# EAGLE design board (EAGLE 9.3.1)
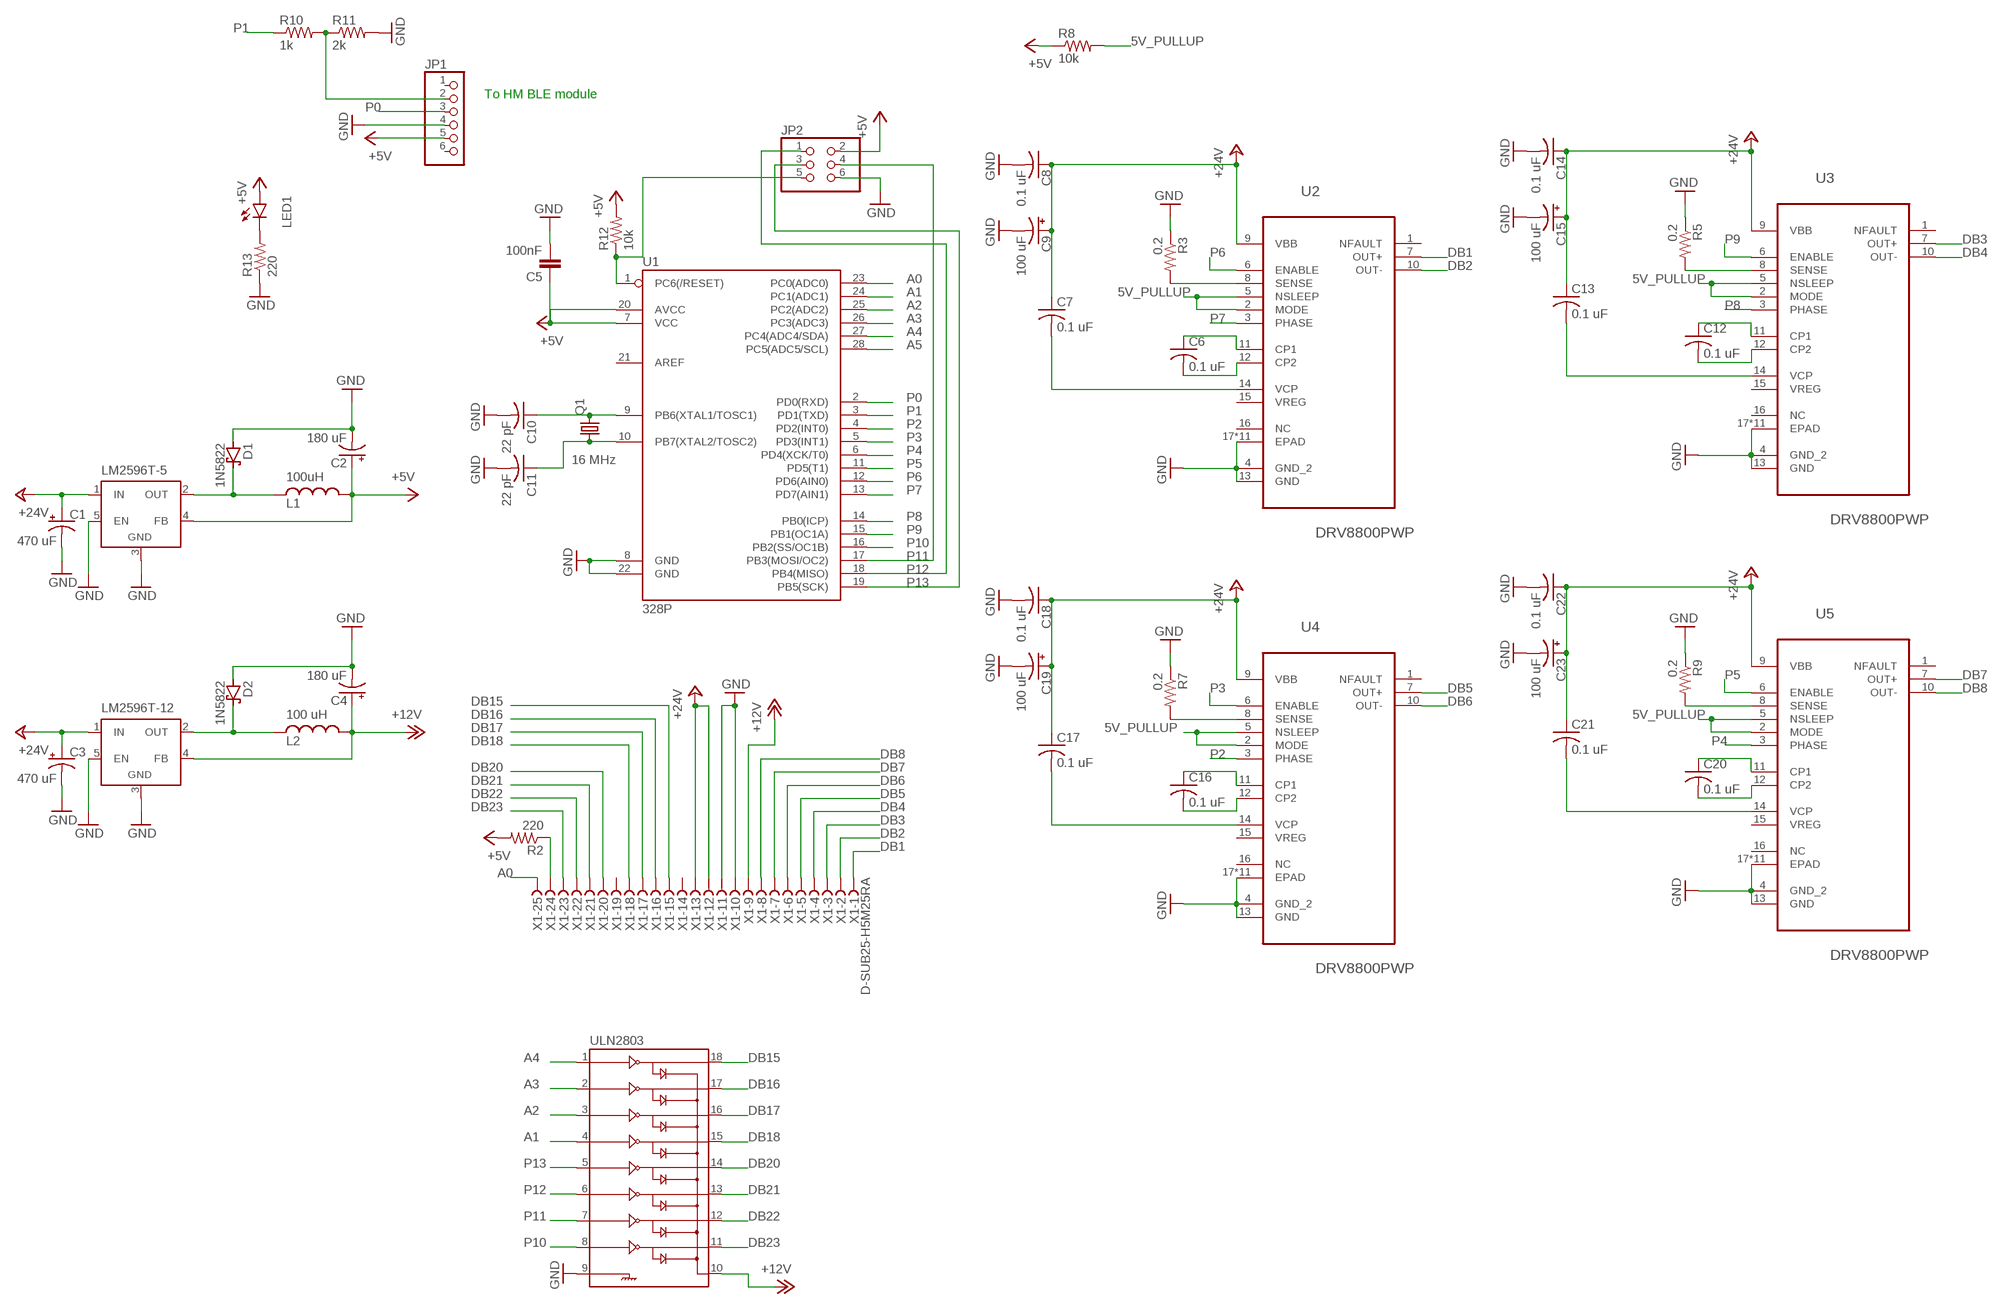
[diagram p0: schematic, sheet 1]

## Parts
C1  470 uF  CPOL-USE3.5-8  [E3,5-8]
C2  180 uF  CPOL-USE3.5-8  [E3,5-8]
C3  470 uF  CPOL-USE3.5-8  [E3,5-8]
C4  180 uF  CPOL-USE3.5-8  [E3,5-8]
C5  100nF  C-EUC0805  [C0805]
C6  0.1 uF  C-USC0805  [C0805]
C7  0.1 uF  C-USC0805  [C0805]
C8  0.1 uF  C-USC0805  [C0805]
C9  100 uF  CPOL-USE3.5-8  [E3,5-8]
C10  22 pF  C-USC0805  [C0805]
C11  22 pF  C-USC0805  [C0805]
C12  0.1 uF  C-USC0805  [C0805]
C13  0.1 uF  C-USC0805  [C0805]
C14  0.1 uF  C-USC0805  [C0805]
C15  100 uF  CPOL-USE3.5-8  [E3,5-8]
C16  0.1 uF  C-USC0805  [C0805]
C17  0.1 uF  C-USC0805  [C0805]
C18  0.1 uF  C-USC0805  [C0805]
C19  100 uF  CPOL-USE3.5-8  [E3,5-8]
C20  0.1 uF  C-USC0805  [C0805]
C21  0.1 uF  C-USC0805  [C0805]
C22  0.1 uF  C-USC0805  [C0805]
C23  100 uF  CPOL-USE3.5-8  [E3,5-8]
D1  1N5822  SCHOTTKY-DIODEDO201T15  [DO201T15]
D2  1N5822  SCHOTTKY-DIODEDO201T15  [DO201T15]
JP1  PINHD-1X6  [1X06]
JP2  PINHD-2X3  [2X03]
L1  100uH  SRR1260  [SRR1260]
L2  100 uH  SRR1260  [SRR1260]
LED1  LED5MM  [LED5MM]
LM2596T-5  LM2596TV  [TO220-51]
LM2596T-12  LM2596TV  [TO220-51]
Q1  16 MHz  CRYSTALHC49S  [HC49/S]
R2  220  R-US_R0805  [R0805]
R3  0.2  R-US_R0805  [R0805]
R5  0.2  R-US_R0805  [R0805]
R7  0.2  R-US_R0805  [R0805]
R8  10k  R-US_R0805  [R0805]
R9  0.2  R-US_R0805  [R0805]
R10  1k  R-US_R0805  [R0805]
R11  2k  R-US_R0805  [R0805]
R12  10k  R-US_R0805  [R0805]
R13  220  R-US_R0805  [R0805]
U1  328P  ATMEGA328P_PDIP  [DIP28]
U2  DRV8800PWP  [SOP65P640X120-17N]
U3  DRV8800PWP  [SOP65P640X120-17N]
U4  DRV8800PWP  [SOP65P640X120-17N]
U5  DRV8800PWP  [SOP65P640X120-17N]
ULN2803  ULN2803DIP  [DIL18]
X1  D-SUB25-H5M25RA  [H5M25RA]

## Nets
5V_PULLUP: R8.2 U2.2(MODE) U2.5(NSLEEP) U3.2(MODE) U3.5(NSLEEP) U4.2(MODE) U4.5(NSLEEP) U5.2(MODE) U5.5(NSLEEP)
+5V: C2.+ C5.1 JP1.5 JP2.2 L1.2 LED1.A LM2596T-5.4(FB) R2.2 R8.1 R12.2 U1.7(VCC) U1.20(AVCC)
+12V: C4.+ L2.2 LM2596T-12.4(FB) ULN2803.10 X1.9
+24V: C1.+ C3.+ C7.1 C8.1 C9.+ C13.1 C14.1 C15.+ C17.1 C18.1 C19.+ C21.1 C22.1 C23.+ LM2596T-5.1(IN) LM2596T-12.1(IN) U2.9(VBB) U3.9(VBB) U4.9(VBB) U5.9(VBB) X1.12 X1.13
A0: U1.23(PC0(ADC0)) X1.25
A1: U1.24(PC1(ADC1)) ULN2803.4
A2: U1.25(PC2(ADC2)) ULN2803.3
A3: U1.26(PC3(ADC3)) ULN2803.2
A4: U1.27(PC4(ADC4/SDA)) ULN2803.1
A5: U1.28(PC5(ADC5/SCL))
DB1: U2.7(OUT+) X1.1
DB2: U2.10(OUT-) X1.2
DB3: U3.7(OUT+) X1.3
DB4: U3.10(OUT-) X1.4
DB5: U4.7(OUT+) X1.5
DB6: U4.10(OUT-) X1.6
DB7: U5.7(OUT+) X1.7
DB8: U5.10(OUT-) X1.8
DB15: ULN2803.18 X1.15
DB16: ULN2803.17 X1.16
DB17: ULN2803.16 X1.17
DB18: ULN2803.15 X1.18
DB20: ULN2803.14 X1.20
DB21: ULN2803.13 X1.21
DB22: ULN2803.12 X1.22
DB23: ULN2803.11 X1.23
GND: C1.- C2.- C3.- C4.- C5.2 C8.2 C9.- C10.2 C11.2 C14.2 C15.- C18.2 C19.- C22.2 C23.- D1.A D2.A JP1.4 JP2.6 LM2596T-5.3(GND) LM2596T-5.5(EN) LM2596T-12.3(GND) LM2596T-12.5(EN) R3.1 R5.1 R7.1 R9.1 R11.2 R13.1 U1.8(GND) U1.22(GND) U2.4(GND_2) U2.13(GND) U2.17(EPAD) U2.18(EPAD) U2.P$1(EPAD) U2.P$2(EPAD) U2.P$3(EPAD) U2.P$4(EPAD) U2.P$5(EPAD) U2.P$6(EPAD) U2.P$7(EPAD) U2.P$8(EPAD) U2.P$9(EPAD) U3.4(GND_2) U3.13(GND) U3.17(EPAD) U3.18(EPAD) U3.P$1(EPAD) U3.P$2(EPAD) U3.P$3(EPAD) U3.P$4(EPAD) U3.P$5(EPAD) U3.P$6(EPAD) U3.P$7(EPAD) U3.P$8(EPAD) U3.P$9(EPAD) U4.4(GND_2) U4.13(GND) U4.17(EPAD) U4.18(EPAD) U4.P$1(EPAD) U4.P$2(EPAD) U4.P$3(EPAD) U4.P$4(EPAD) U4.P$5(EPAD) U4.P$6(EPAD) U4.P$7(EPAD) U4.P$8(EPAD) U4.P$9(EPAD) U5.4(GND_2) U5.13(GND) U5.17(EPAD) U5.18(EPAD) U5.P$1(EPAD) U5.P$2(EPAD) U5.P$3(EPAD) U5.P$4(EPAD) U5.P$5(EPAD) U5.P$6(EPAD) U5.P$7(EPAD) U5.P$8(EPAD) U5.P$9(EPAD) ULN2803.9 X1.10 X1.11
N$1: D1.C L1.1 LM2596T-5.2(OUT)
N$2: C6.1 U2.11(CP1)
N$3: D2.C L2.1 LM2596T-12.2(OUT)
N$4: C6.2 U2.12(CP2)
N$6: C7.2 U2.14(VCP)
N$7: R2.1 X1.24
N$8: C10.1 Q1.2 U1.9(PB6(XTAL1/TOSC1))
N$9: C11.1 Q1.1 U1.10(PB7(XTAL2/TOSC2))
N$10: R3.2 U2.8(SENSE)
N$11: C12.1 U3.11(CP1)
N$12: C12.2 U3.12(CP2)
N$14: C13.2 U3.14(VCP)
N$15: R5.2 U3.8(SENSE)
N$16: C16.1 U4.11(CP1)
N$17: C16.2 U4.12(CP2)
N$19: C17.2 U4.14(VCP)
N$20: R7.2 U4.8(SENSE)
N$21: C20.1 U5.11(CP1)
N$22: C20.2 U5.12(CP2)
N$24: C21.2 U5.14(VCP)
N$25: R9.2 U5.8(SENSE)
N$26: JP1.2 R10.2 R11.1
N$27: JP2.5 R12.1 U1.1(PC6(/RESET))
N$28: LED1.K(C) R13.2
P0: JP1.3 U1.2(PD0(RXD))
P1: R10.1 U1.3(PD1(TXD))
P2: U1.4(PD2(INT0)) U4.3(PHASE)
P3: U1.5(PD3(INT1)) U4.6(ENABLE)
P4: U1.6(PD4(XCK/T0)) U5.3(PHASE)
P5: U1.11(PD5(T1)) U5.6(ENABLE)
P6: U1.12(PD6(AIN0)) U2.6(ENABLE)
P7: U1.13(PD7(AIN1)) U2.3(PHASE)
P8: U1.14(PB0(ICP)) U3.3(PHASE)
P9: U1.15(PB1(OC1A)) U3.6(ENABLE)
P10: U1.16(PB2(SS/OC1B)) ULN2803.8
P11: JP2.4 U1.17(PB3(MOSI/OC2)) ULN2803.7
P12: JP2.1 U1.18(PB4(MISO)) ULN2803.6
P13: JP2.3 U1.19(PB5(SCK)) ULN2803.5
Unconnected: JP1.1 JP1.6 U1.21(AREF) U2.1(NFAULT) U2.15(VREG) U2.16(NC) U3.1(NFAULT) U3.15(VREG) U3.16(NC) U4.1(NFAULT) U4.15(VREG) U4.16(NC) U5.1(NFAULT) U5.15(VREG) U5.16(NC) X1.14 X1.19

## Notes on the sheet
- To HM BLE module

## Library data of the parts
C1-C4 C9 C15 C19 C23 = rcl:CPOL-US: POLARIZED CAPACITOR, American symbol; SPICEPREFIX: C
C5 = rcl:C-EU: CAPACITOR, European symbol; SPICEPREFIX: C
C6-C8 C10-C14 C16-C18 C20-C22 = rcl:C-US: CAPACITOR, American symbol; SPICEPREFIX: C
D1 D2 = diode:SCHOTTKY-DIODE: Schottky Diode
JP1 = pinhead:PINHD-1X6: PIN HEADER
JP2 = pinhead:PINHD-2X3: PIN HEADER
L1 L2 = bourns:SRR1260
LED1 = led:LED: LED OSRAM: - CHIPLED LG R971, LG N971, LY N971, LG Q971, LY Q971, LO R971, LY R971 LH N974, LH R974 LS Q976, LO Q976, LY Q976 LO Q996 - Hyper CHIPLED LW Q18S LB Q993, LB Q99A, LB R99A - SideLED LS A670, LO A670, LY A670, LG A670, LP A670 LB A673, LV A673, LT A673, LW A673 LH A674 LY A675 LS A676, LA A676, LO A676, LY A676, LW A676 LS A679, LY A679, LG A679 - Hyper Micro SIDELED® LS Y876, LA Y876, LO Y876, LY Y876 LT Y87S - SmartLED LW L88C, LW L88S LB L89C, LB L89S, LG L890 LS L89K, LO L89K, LY L89K LS L896, LA L896, LO L896, LY L896 - TOPLED LS T670, LO T670, LY T670, LG T670, LP T670 LSG T670, LSP T670, LSY T670, LOP T670, LYG T670 LG T671, LOG T671, LSG T671 LB T673, LV T673, LT T673, LW T673 LH T674 LS T676, LA T676, LO T676, LY T676, LB T676, LH T676, LSB T676, LW T676 LB T67C, LV T67C, LT T67C, LS T67K, LO T67K, LY T67K, LW E67C LS E67B, LA E67B, LO E67B, LY E67B, LB E67C, LV E67C, LT E67C LW T67C LS T679, LY T679, LG T679 LS T770, LO T770, LY T770, LG T770, LP T770 LB T773, LV T773, LT T773, LW T773 LH T774 LS E675, LA E675, LY E675, LS T675 LS T776, LA T776, LO T776, LY T776, LB T776 LHGB T686 LT T68C, LB T68C - Hyper Mini TOPLED® LB M676 - Mini TOPLED Santana® LG M470 LS M47K, LO M47K, LY M47K Source: http://www.osram.convergy.de LUXEON: - LUMILED® LXK2-PW12-R00, LXK2-PW12-S00, LXK2-PW14-U00, LXK2-PW14-V00 LXK2-PM12-R00, LXK2-PM12-S00, LXK2-PM14-U00 LXK2-PE12-Q00, LXK2-PE12-R00, LXK2-PE12-S00, LXK2-PE14-T00, LXK2-PE14-U00 LXK2-PB12-K00, LXK2-PB12-L00, LXK2-PB12-M00, LXK2-PB14-N00, LXK2-PB14-P00, LXK2-PB14-Q00 LXK2-PR12-L00, LXK2-PR12-M00, LXK2-PR14-Q00, LXK2-PR14-R00 LXK2-PD12-Q00, LXK2-PD12-R00, LXK2-PD12-S00 LXK2-PH12-R00, LXK2-PH12-S00 LXK2-PL12-P00, LXK2-PL12-Q00, LXK2-PL12-R00 Source: www.luxeon.com KINGBRIGHT: KA-3528ASYC Source: www.kingbright.com
LM2596T-5 LM2596T-12 = linear:LM2596T: STEP-DOWN VOLTAGE REGULATOR
Q1 = adafruit:CRYSTAL: CRYSTAL; OC_FARNELL: 1667008; OC_NEWARK: unknown
R2 R3 R5 R7-R13 = rcl:R-US_: RESISTOR, American symbol; SPICEPREFIX: R
U1 = SparkFun-IC-Microcontroller:ATMEGA328P_PDIP: Atmel 328P Through hole ATMEGA328P uC used in the Arduino 32kb flash, 1k EEPROM, 2k SRAM Datasheet <http://www.sparkfun.com/datasheets/Components/SMD/ATMega328.pdf> SparkFun Products Storefront component: AVR 28 Pin 20MHz 32K 6A/D - ATMega328P <https://www.sparkfun.com/products/9061> (COM-09061) SparkFun Simon Says - Through-Hole Soldering Kit <https://www.sparkfun.com/products/10547> (KIT-10547) SparkFun Learn to Solder - Simon Says <https://www.sparkfun.com/products/13708> (KIT-13708) SparkFun BigTime Watch Kit <https://www.sparkfun.com/products/11734> (KIT-11734) SparkFun ClockIt <https://www.sparkfun.com/products/10930> (KIT-10930) SparkFun Serial Enabled LCD Kit <https://www.sparkfun.com/products/10097> (LCD-10097) SparkFun Simon Tilts - Through Hole Soldering Kit <https://www.sparkfun.com/products/12634> (KIT-12634) SparkFun Frequency Counter Kit <https://www.sparkfun.com/products/10140> (KIT-10140) FabFM Radio Kit <https://www.sparkfun.com/products/11043> (KIT-11043) SparkFun Binary Blaster Kit <https://www.sparkfun.com/products/12037> (KIT-12037) SparkFun Metro-Gnome <https://www.sparkfun.com/products/9236> (KIT-09236) ATmega328 with Arduino Optiboot (Uno) <https://www.sparkfun.com/products/10524> (DEV-10524); PROD_ID: IC-09136
U2-U5 = custom:DRV8800PWP: DMOS FULL-BRIDGE MOTOR DRIVERS; MPN: DRV8800PWP; OC_FARNELL: -; OC_NEWARK: 24R9112; PACKAGE: TSSOP-16; SUPPLIER: Texas Instruments
ULN2803 = SparkFun-IC-Special-Function:ULN2803: Darlington Driver(IC-07959, low stock) ULN2803 Darlington array. 500mA max per channel, 8-channel package. Spark Fun Electronics SKU : COM-00312
X1 = con-thomas-betts:D-SUB25-: D-Subminiatur Connector Source: Electronioc Interconnects European Edition 1998; MPN: H5M25RA29CS; OC_FARNELL: unknown; OC_NEWARK: 93F8324

## Board
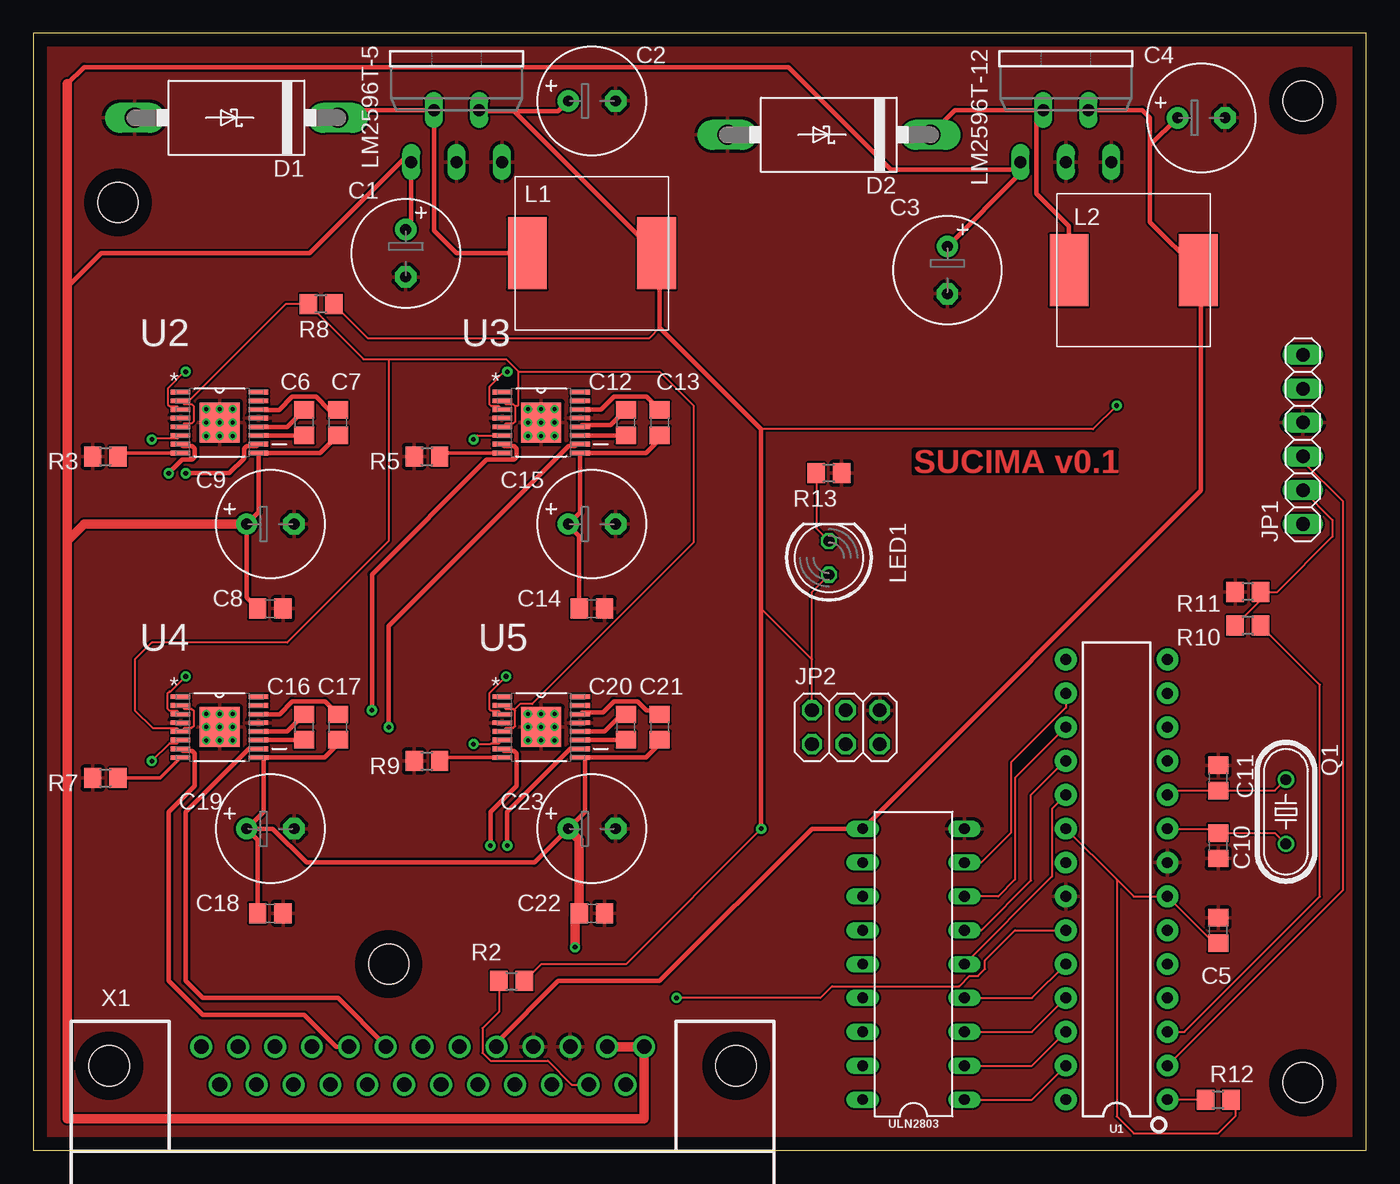
[diagram p1: board, top side]
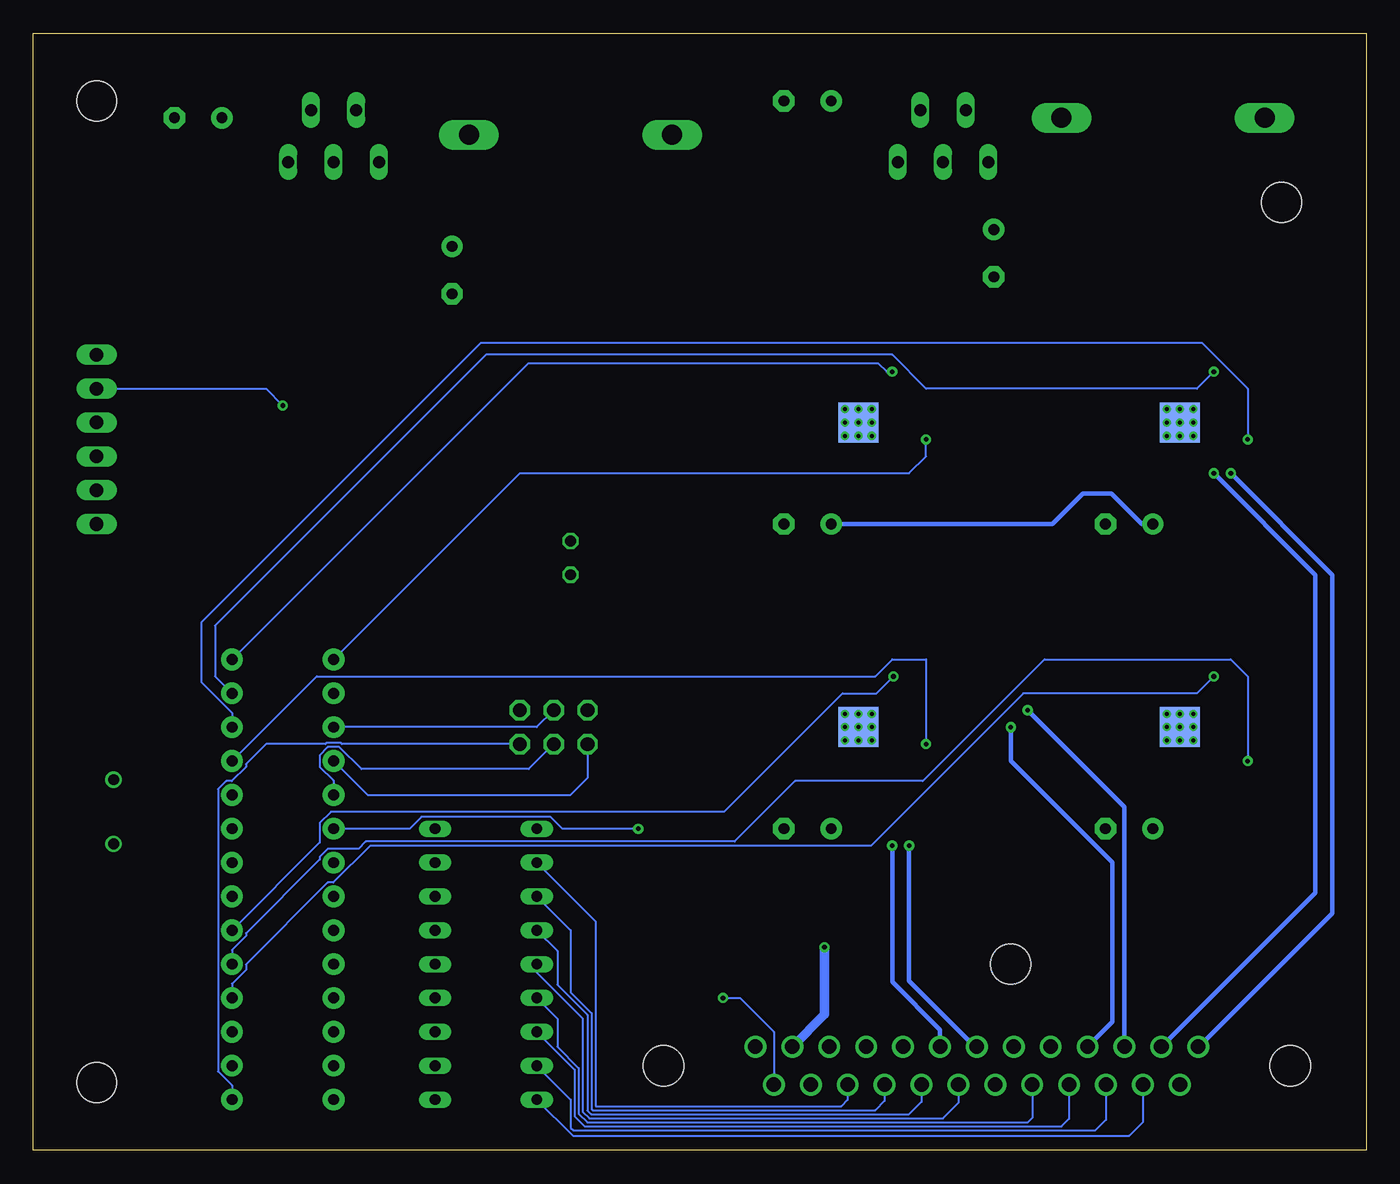
[diagram p2: board, bottom side, seen from below]

Size 100 x 83.81 mm. Coordinates in mm from the lower left corner, seen from the top.
Outline: 0,0 100,0 100,83.81 0,83.81 0,0
Copper layers (1*16): Top 0.035mm / dielectric 1.5mm / Bottom 0.035mm
Design rules "default *": minimum track width 6mil, minimum drill 0.3mm, track to track 6mil, track to pad 6mil, pad to pad 6mil, via to via 6mil, smd to smd 6mil, copper to edge 40mil, drill to drill 6mil, minimum pad ring 6mil, minimum via ring 8mil, stop-mask expansion 4mil, vias tented up to drill 14mil, thermal gap 10mil
Holes 3 mm at 95.25,5.08 95.25,78.74 6.35,71.12 26.67,13.97

### Footprints (pad centres in the part's own frame; a part is rotated, then mirrored left to right if it is on the bottom)
E3,5-8 = drill 0.813 pad 1.6: + -1.778,0 | drill 0.813 pad 1.6 octagon: - 1.778,0
C0805 = smd 1.3 x 1.5: 1 -0.95,0; 2 0.95,0
DO201T15 = drill 1.499 long: A 7.62,0; C -7.62,0
1X06 = drill 1.016 long: 1 -6.35,0; 2 -3.81,0; 3 -1.27,0; 4 1.27,0; 5 3.81,0; 6 6.35,0
2X03 = drill 1.016 octagon: 1 -2.54,-1.27; 2 -2.54,1.27; 3 0,-1.27; 4 0,1.27; 5 2.54,-1.27; 6 2.54,1.27
SRR1260 = smd 2.9 x 5.4: 1 -4.85,0; 2 4.85,0
LED5MM = drill 0.813 octagon: A -1.27,0; K 1.27,0
TO220-51 = drill 0.9 long: 1 -3.4,-8.4; 2 -1.7,-4.5; 3 0,-8.4; 4 1.7,-4.5; 5 3.4,-8.4
HC49/S = drill 0.813: 1 -2.413,0; 2 2.413,0
R0805 = smd 1.3 x 1.5: 1 -0.95,0; 2 0.95,0
DIP28 = drill 0.813 pad 1.626: 1 -16.51,-3.81; 2 -13.97,-3.81; 3 -11.43,-3.81; 4 -8.89,-3.81; 5 -6.35,-3.81; 6 -3.81,-3.81; 7 -1.27,-3.81; 8 1.27,-3.81; 9 3.81,-3.81; 10 6.35,-3.81; 11 8.89,-3.81; 12 11.43,-3.81; 13 13.97,-3.81; 14 16.51,-3.81; 15 16.51,3.81; 16 13.97,3.81; 17 11.43,3.81; 18 8.89,3.81; 19 6.35,3.81; 20 3.81,3.81; 21 1.27,3.81; 22 -1.27,3.81; 23 -3.81,3.81; 24 -6.35,3.81; 25 -8.89,3.81; 26 -11.43,3.81; 27 -13.97,3.81; 28 -16.51,3.81
SOP65P640X120-17N = smd 1.473 x 0.356: 1 -2.921,2.286; 2 -2.921,1.626; 3 -2.921,0.965; 4 -2.921,0.33; 5 -2.921,-0.33; 6 -2.921,-0.965; 7 -2.921,-1.626; 8 -2.921,-2.286; 9 2.921,-2.286; 10 2.921,-1.626; 11 2.921,-0.965; 12 2.921,-0.33; 13 2.921,0.33; 14 2.921,0.965; 15 2.921,1.626; 16 2.921,2.286 | smd 2.997 x 2.997: 17 0,0 | smd 2.997 x 2.997 bottom: 18 0,0 | drill 0.3 pad 0.5: P$1 -1,1; P$2 0,1; P$3 1,1; P$4 1,0; P$5 0,0; P$6 -1,0; P$7 -1,-1; P$8 0,-1; P$9 1,-1
DIL18 = drill 0.813 long: 1 -10.16,-3.81; 2 -7.62,-3.81; 3 -5.08,-3.81; 4 -2.54,-3.81; 5 0,-3.81; 6 2.54,-3.81; 7 5.08,-3.81; 8 7.62,-3.81; 9 10.16,-3.81; 10 10.16,3.81; 11 7.62,3.81; 12 5.08,3.81; 13 2.54,3.81; 14 0,3.81; 15 -2.54,3.81; 16 -5.08,3.81; 17 -7.62,3.81; 18 -10.16,3.81
H5M25RA = drill 1.092: 1 -16.612,1.422; 2 -13.843,1.422; 3 -11.074,1.422; 4 -8.306,1.422; 5 -5.537,1.422; 6 -2.769,1.422; 7 0,1.422; 8 2.769,1.422; 9 5.537,1.422; 10 8.306,1.422; 11 11.074,1.422; 12 13.843,1.422; 13 16.612,1.422; 14 -15.227,-1.422; 15 -12.459,-1.422; 16 -9.69,-1.422; 17 -6.921,-1.422; 18 -4.153,-1.422; 19 -1.384,-1.422; 20 1.384,-1.422; 21 4.153,-1.422; 22 6.921,-1.422; 23 9.69,-1.422; 24 12.459,-1.422; 25 15.227,-1.422 | hole 3.048: -23.52,0; 23.52,0

### Placement (x,y rotation side)
C1  27.94,67.31 270 top
C2  41.91,78.74 0 top
C3  68.58,66.04 270 top
C4  87.63,77.47 0 top
C5  88.9,16.51 90 top
C6  20.32,54.61 90 top
C7  22.86,54.61 90 top
C8  17.78,40.64 0 top
C9  17.78,46.99 0 top
C10  88.9,22.86 270 top
C11  88.9,27.94 90 top
C12  44.45,54.61 90 top
C13  46.99,54.61 90 top
C14  41.91,40.64 0 top
C15  41.91,46.99 0 top
C16  20.32,31.75 90 top
C17  22.86,31.75 90 top
C18  17.78,17.78 0 top
C19  17.78,24.13 0 top
C20  44.45,31.75 90 top
C21  46.99,31.75 90 top
C22  41.91,17.78 0 top
C23  41.91,24.13 0 top
D1  15.24,77.47 180 top
D2  59.69,76.2 180 top
JP1  95.25,53.34 90 top
JP2  60.96,31.75 0 top
L1  41.91,67.31 0 top
L2  82.55,66.04 0 top
LED1  59.69,44.45 90 top
LM2596T-5  31.75,82.55 0 top
LM2596T-12  77.47,82.55 0 top
Q1  93.98,25.4 270 top
R2  35.88,12.7 0 top
R3  5.4,52.07 0 top
R5  29.53,52.07 0 top
R7  5.4,27.94 0 top
R8  21.59,63.5 180 top
R9  29.53,29.21 0 top
R10  91.12,39.37 180 top
R11  91.12,41.91 180 top
R12  88.9,3.81 0 top
R13  59.69,50.8 180 top
U1  81.28,20.32 90 top
U2  13.97,54.61 0 top
U3  38.1,54.61 0 top
U4  13.97,31.75 0 top
U5  38.1,31.75 0 top
ULN2803  66.04,13.97 90 top
X1  29.21,6.35 0 top

### Tracks (layer width: path | path; a pad name or v marks a point on that pad's centre or on a via)
5V_PULLUP
  Top 0.152: U2.5 11.3,54.53 11.88,54.53 12.01,54.67 12.01,55.85 11.88,55.98 11.43,55.98 | U2.2 11.3,55.98 11.43,55.98 | 36.14,55.85 36.01,55.98 35.43,55.98 U3.2 | U3.5 35.43,54.53 36.01,54.53 36.14,54.67 36.14,55.85 | U4.2 11.3,33.12 11.88,33.12 12.01,32.99 12.01,31.81 11.88,31.67 11.3,31.67 U4.5 10.79,31.67 8.97,31.67 7.62,33.02 7.62,36.83 8.89,38.1 19.05,38.1 26.67,45.72 26.67,59.36 | U5.5 35.43,31.67 36.01,31.67 36.14,31.81 36.14,32.99 36.08,33.05 | U5.2 35.43,33.12 36.01,33.12 36.08,33.05 | 11.43,55.98 18.95,63.5 R8.2 24.78,59.36 26.67,59.36 | 36.37,58.42 36.37,58.47 35.48,59.36 26.67,59.36 | 36.37,58.42 36.37,55.88 36.34,55.85 36.14,55.85 | 36.37,58.42 46.99,58.42 49.53,55.88 49.53,45.59 37.42,33.48 36.51,33.48 36.08,33.05
+5V  (via drill 0.35)
  Top 0.152: LM2596T-5.4 33.52,77.97 | 46.73,67.31 L1.2 46.99,67.08 | C5.1 88.45,15.69 U1.7 82.55,19.05 81.28,20.32 | R2.2 38.1,13.97 44.45,13.97 v54.61,24.13 | U1.20 81.28,20.32 | v81.28,55.88 79.5,54.1 54.61,54.1 | JP2.2 58.42,36.83 | 58.42,36.83 58.42,41.91 LED1.A | 81.28,20.32 81.28,2.54 82.55,1.27 88.9,1.27 90.17,2.54 90.17,3.81 R12.2 | 46.99,61.72 46.23,60.96 25.08,60.96 R8.1 | 54.61,40.64 58.42,36.83
  Top 0.356: 46.73,67.31 36.06,77.97 | 36.06,77.97 33.52,77.97 | v54.61,24.13 54.61,40.64 54.61,54.1 46.99,61.72 46.99,67.08 | 36.06,77.97 39.37,77.97 C2.+
  Bottom 0.152: JP1.5 82.55,57.15 v81.28,55.88 | v54.61,24.13 60.31,24.13 61.2,25.02 70.88,25.02 71.77,24.13 U1.20
+12V
  Top 0.152: 87.59,66.04 87.4,66.23 L2.2
  Top 0.356: LM2596T-12.4 83.2,78.05 83.78,77.47 83.78,75.4 | 87.59,66.04 87.59,49.49 ULN2803.10 58.42,24.13 46.99,12.7 39.37,12.7 34.75,8.08 X1.9 | L2.2 83.78,69.66 83.78,75.4 | C4.+ 83.78,75.4
+24V  (via drill 0.35)
  Top 0.152: C1.+ 28.35,69.5 | 28.35,74.93 LM2596T-5.1 | U3.9 41,52.22 | C15.+ 40.14,46.92 | C17.1 22.86,30.48 | C21.1 46.99,30.48 | U5.9 41.41,29.46 41.4,29.46 | 46.99,53.34 C13.1 | 40.8,17.62 C22.1 | 16.89,52.07 U2.9 | U4.9 17.27,29.46
  Top 0.356: LM2596T-5.1 28.35,69.5 | C3.+ 74.07,73.31 74.07,73.58 | C8.1 16,41.47 C9.+ 16.89,47.88 16.89,52.07 | 17.27,29.46 17.27,25.4 C19.+ | C19.+ 16.83,23.3 C18.1 | 41,52.22 41,47.86 C15.+ | 40.14,46.92 40.96,46.1 C14.1 | 41.4,29.46 41.4,25.4 C23.+ 37.59,21.59 20.5,21.59 17.96,24.13 C19.+ | 28.35,74.93 20.73,67.31 5.08,67.31 2.54,64.77 | 74.07,73.58 64.36,73.58 56.65,81.28 3.81,81.28 2.54,80.01 | U3.9 45.97,52.32 46.99,53.34 | 46.99,30.48 45.97,29.46 41.41,29.46 | LM2596T-12.1 74.07,73.58 | U4.9 21.84,29.46 22.86,30.48 | C7.1 21.52,52.32 U2.9
  Top 0.711: C23.+ 40.96,23.3 C22.1 | 2.54,45.72 2.54,2.36 45.82,2.36 X1.13 X1.12 | 2.54,45.72 2.54,64.77 2.54,80.01 | 2.54,45.72 3.81,46.99 C9.+ | v40.64,15.24 40.64,17.46 40.8,17.62
  Bottom 0.356: C9.+ 16.83,46.99 19.13,49.29 21.25,49.29 23.55,46.99 C15.+
  Bottom 0.711: X1.12 40.64,10.19 v40.64,15.24
A0  (via drill 0.35)
  Top 0.152: U1.23 73.66,16.51 71.4,14.25 71.4,13.6 70.88,13.08 70.23,13.08 69.47,12.32 59.93,12.32 59.04,11.43 v48.26,11.43
  Bottom 0.152: v48.26,11.43 46.99,11.43 44.44,8.88 X1.25
A1
  Top 0.152: U1.24 74.93,11.43 ULN2803.4
A2
  Top 0.152: U1.25 74.93,8.89 ULN2803.3
A3
  Top 0.152: U1.26 74.93,6.35 ULN2803.2
A4
  Top 0.152: U1.27 74.93,3.81 ULN2803.1
DB1  (via drill 0.35)
  Top 0.356: U2.7 11.2,52.83 11.92,52.83 12.12,52.64 12.12,52.01 11.92,51.82 11.18,51.82 v10.16,50.8
  Bottom 0.152: 12.55,7.77 X1.1
  Bottom 0.356: 12.55,7.77 2.54,17.78 2.54,43.18 v10.16,50.8
DB2  (via drill 0.35)
  Top 0.356: v11.43,50.8 14.71,50.8 15.82,51.92 15.82,52.64 16.02,52.83 16.74,52.83 U2.10
  Bottom 0.356: v11.43,50.8 3.81,43.18 3.81,19.33 X1.2
DB3  (via drill 0.35)
  Top 0.356: v25.4,33.02 25.4,43.2 34.01,51.82 36.05,51.82 36.25,52.01 36.25,52.64 36.05,52.83 35.33,52.83 U3.7
  Bottom 0.356: v25.4,33.02 24.13,31.75 18.14,25.76 X1.3
DB4  (via drill 0.35)
  Top 0.356: v26.67,31.75 26.67,39.35 40.15,52.83 40.64,52.83 40.79,52.98 U3.10
  Bottom 0.356: v26.67,31.75 26.67,29.21 19.05,21.59 19.05,9.63 X1.4
DB5
  Top 0.356: X1.5 22.71,7.77 20.32,10.16 12.7,10.16 10.16,12.7 10.16,25.4 12.12,27.36 12.12,29.78 11.92,29.97 11.2,29.97 U4.7
DB6
  Top 0.152: 26.44,7.85 X1.6
  Top 0.356: 26.44,7.85 22.86,11.43 12.7,11.43 11.43,12.7 11.43,25.4 16.15,30.12 U4.10
DB7  (via drill 0.35)
  Top 0.356: U5.7 35.33,29.97 36.05,29.97 36.25,29.78 36.25,27.36 34.29,25.4 v34.29,22.86
  Bottom 0.152: X1.7 29.29,7.7
  Bottom 0.356: v34.29,22.86 34.29,12.7 29.29,7.7
DB8  (via drill 0.35)
  Top 0.152: U5.10 40.28,30.12
  Top 0.356: v35.56,22.86 35.56,25.4 40.28,30.12
  Bottom 0.356: v35.56,22.86 35.56,12.62 31.98,9.04 X1.8
DB15
  Bottom 0.152: ULN2803.18 59.51,1.09 17.78,1.09 16.75,2.12 X1.15
DB16
  Bottom 0.152: ULN2803.17 59.69,3.81 59.69,1.7 59.47,1.49 20.32,1.49 19.52,2.29 X1.16
DB17
  Bottom 0.152: ULN2803.16 59.38,6.04 59.38,2.54 58.64,1.79 22.86,1.79 22.29,2.36 X1.17
DB18
  Bottom 0.152: ULN2803.15 60.68,9.88 60.68,7.77 59.08,6.17 59.08,2.76 58.42,2.1 25.4,2.1 25.06,2.44 X1.18
DB20
  Bottom 0.152: ULN2803.14 62.23,13.35 58.78,9.89 58.78,2.9 58.28,2.4 31.75,2.4 30.59,3.56 X1.20
DB21
  Bottom 0.152: ULN2803.13 60.68,14.96 60.68,12.42 58.42,10.16 58.42,2.97 58.15,2.71 34.29,2.71 33.36,3.63 X1.21
DB22
  Bottom 0.152: ULN2803.12 59.69,16.51 59.69,11.86 58.12,10.29 58.12,3.1 58.03,3.01 36.83,3.01 36.13,3.71 X1.22
DB23
  Bottom 0.152: ULN2803.11 57.81,17.17 57.81,3.31 39.37,3.31 38.9,3.78 X1.23
GND
  pour Top: 0,83.82 100.33,83.82 100.33,0 0,0
N$1
  Top 0.356: D1.C 23.44,78.05 LM2596T-5.2 30.05,69.01 31.75,67.31 L1.1
N$2
  Top 0.152: 20.3,53.65 C6.1
  Top 0.356: U2.11 20.3,53.65
N$3
  Top 0.356: D2.C 69.16,78.05 LM2596T-12.2 75.27,77.55 75.27,71.79 77.7,69.36 L2.1
N$4
  Top 0.152: 17.47,54.28 U2.12
  Top 0.356: C6.2 19.04,54.28 17.47,54.28
N$6
  Top 0.152: 16.91,55.56 U2.14
  Top 0.356: C7.2 22.19,55.56 21.21,56.54 19.43,56.54 18.45,55.56 16.91,55.56
N$7
  Top 0.152: R2.1 34.93,10.4 33.7,9.17 33.7,7.32 34.29,6.72 38.6,6.72 40.4,4.93 X1.24
N$8
  Top 0.152: U1.9 88.58,24.13 C10.1 93.16,23.81 Q1.2
N$9
  Top 0.152: U1.10 85.41,26.99 C11.1 93.16,26.99 Q1.1
N$10
  Top 0.152: R3.2 6.6,52.32
  Top 0.254: 6.6,52.32 U2.8
N$11
  Top 0.356: U3.11 44.44,53.65 C12.1
N$12
  Top 0.356: C12.2 43.32,54.43 41.17,54.43 U3.12
N$14
  Top 0.356: U3.14 42.6,55.58 43.56,56.54 46.01,56.54 C13.2
N$15
  Top 0.152: 30.73,52.32 R5.2
  Top 0.254: U3.8 30.73,52.32
N$16
  Top 0.356: C16.1 20.3,30.79 U4.11
N$17
  Top 0.356: C16.2 19.04,31.42 U4.12
N$19
  Top 0.356: U4.14 18.47,32.72 19.43,33.68 21.88,33.68 C17.2
N$20
  Top 0.254: U4.8 9.53,27.94 R7.2
N$21
  Top 0.356: C20.1 U5.11
N$22
  Top 0.152: C20.2 44.13,32.7
  Top 0.356: U5.12 42.85,31.42 44.13,32.7
N$24
  Top 0.356: C21.2 46.99,33.02 46,33.02 45.34,33.68 43.56,33.68 42.75,32.87 41.17,32.87 U5.14
N$25
  Top 0.152: 31.05,29.46 R9.2
  Top 0.254: U5.8 31.05,29.46
N$26
  Top 0.152: JP1.2 97.47,47.31 97.47,46.04 93.34,41.91 R11.1 92.39,42.23 92.39,41.59 R10.2
N$27
  Top 0.152: R12.1 U1.1
  Bottom 0.152: JP2.5 76.84,30.48 76.91,30.56 78.03,30.56 78.1,30.48 82.55,30.48 84.05,28.98 84.05,28.78 85.12,27.71 85.52,27.71 86.13,27.1 86.13,5.92 85.09,4.88 U1.1
N$28
  Top 0.152: R13.2 58.74,46.67 LED1.K
P0
  Top 0.152: U1.2 98.27,19.53 98.27,48.67 95.25,51.69 JP1.3
P1
  Top 0.152: U1.3 86.36,8.89 96.52,19.05 96.52,34.92 R10.1
P2  (via drill 0.35)
  Top 0.152: U4.3 10.79,32.97 10.22,32.97 10.08,33.1 10.08,34.31 10.22,34.44 10.31,34.44 v11.43,35.56
  Bottom 0.152: v11.43,35.56 12.7,34.29 25.72,34.29 37.15,22.86 74.73,22.86 77.5,20.09 77.9,20.09 84.05,13.94 84.05,13.54 85.09,12.5 U1.4
P3  (via drill 0.35)
  Top 0.152: v8.89,29.21 v8.9,29.21 10.22,30.53 10.79,30.53 U4.6
  Bottom 0.152: U1.5 85.09,15.04 84.05,16.08 84.05,16.28 78.51,21.82 78.51,22.02 77.9,22.63 75.59,22.63 75.06,23.16 47.38,23.16 42.84,27.7 33.26,27.7 24.13,36.83 10.16,36.83 8.89,35.56 v8.89,29.21
P4  (via drill 0.35)
  Top 0.152: U5.3 34.92,32.97 34.35,32.97 34.21,33.1 34.21,34.31 v35.47,35.56
  Bottom 0.152: v35.47,35.56 36.73,34.29 39.27,34.29 48.16,25.4 77.67,25.4 78.51,24.56 78.51,23.09 U1.6
P5  (via drill 0.35)
  Top 0.152: v33.02,30.48 34.3,30.48 34.35,30.53 34.92,30.53 U5.6
  Bottom 0.152: U1.11 78.74,35.56 36.83,35.56 35.56,36.83 33.02,36.83 v33.02,30.48
P6  (via drill 0.35)
  Top 0.152: v8.89,53.34 8.94,53.39 10.79,53.39 U2.6
  Bottom 0.152: U1.12 85.09,32.82 87.4,35.13 87.4,39.6 66.4,60.6 12.34,60.6 8.89,57.15 v8.89,53.34
P7  (via drill 0.35)
  Top 0.152: v11.43,58.42 11.34,58.42 10.08,57.17 10.08,55.96 10.22,55.83 10.79,55.83 U2.3
  Bottom 0.152: v11.43,58.42 12.7,57.15 33.02,57.15 35.56,59.69 66.04,59.69 86.36,39.37 86.36,35.56 U1.13
P8  (via drill 0.35)
  Top 0.152: U3.3 34.92,55.83 34.35,55.83 34.21,55.96 34.21,57.3 35.33,58.42 v35.56,58.42
  Bottom 0.152: U1.14 62.89,59.03 36.58,59.03 35.97,58.42 v35.56,58.42
P9  (via drill 0.35)
  Top 0.152: v33.02,53.34 33.33,53.65 U3.6
  Bottom 0.152: U1.15 63.5,50.8 34.29,50.8 33.02,52.07 v33.02,53.34
P10
  Top 0.152: U1.16 77.47,33.22 73.36,29.11 73.36,23.82 71.12,21.59 ULN2803.8
P11
  Top 0.152: U1.17 73.66,27.94 73.66,20.32 72.39,19.05 ULN2803.7
  Bottom 0.152: JP2.4 62.23,31.75 U1.17
P12
  Top 0.152: ULN2803.6 71.12,16.51 74.85,20.24 74.85,26.67 77.39,29.21 U1.18
  Bottom 0.152: JP2.1 58.42,27.94 59.69,26.67 74.93,26.67 U1.18
P13
  Top 0.152: U1.19 76.43,25.63 76.43,20.55 ULN2803.5
  Bottom 0.152: JP2.3 62.84,28.6 75.39,28.6 77.04,30.25 77.9,30.25 78.51,29.64 78.51,28.78 77.47,27.74 U1.19

### Text on the board
Top: SUCIMA v0.1